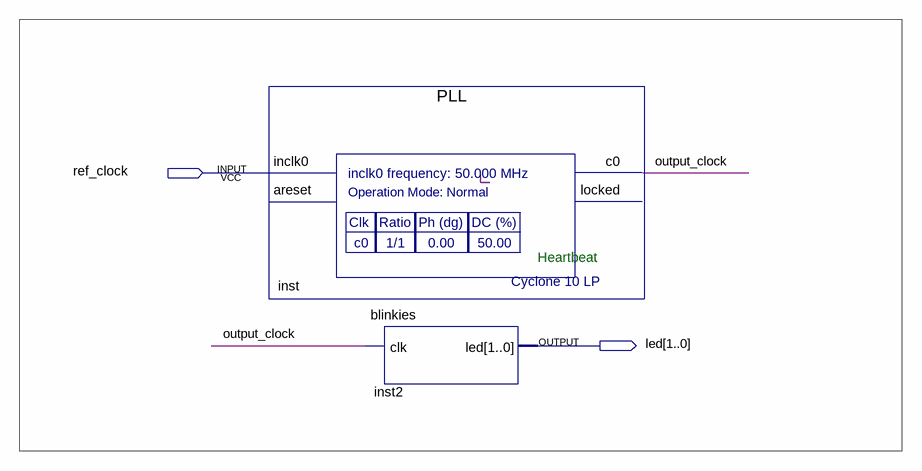
[diagram p0: schematic sheet]
// Quartus schematic Avalon_MM_Study_Top.bdf as structural Verilog: 2 symbols, 2 pins
module Avalon_MM_Study_Top (
  input  ref_clock,
  output [1:0] led
);

  wire output_clock;

  PLL inst (.inclk0(ref_clock), .c0(output_clock));  // open: areset, locked
  blinkies inst2 (.clk(output_clock), .led(led));

  // Notes on the sheet:
  //   Heartbeat
endmodule
